# EAGLE schematic ascender_board (EAGLE 6.6.0)
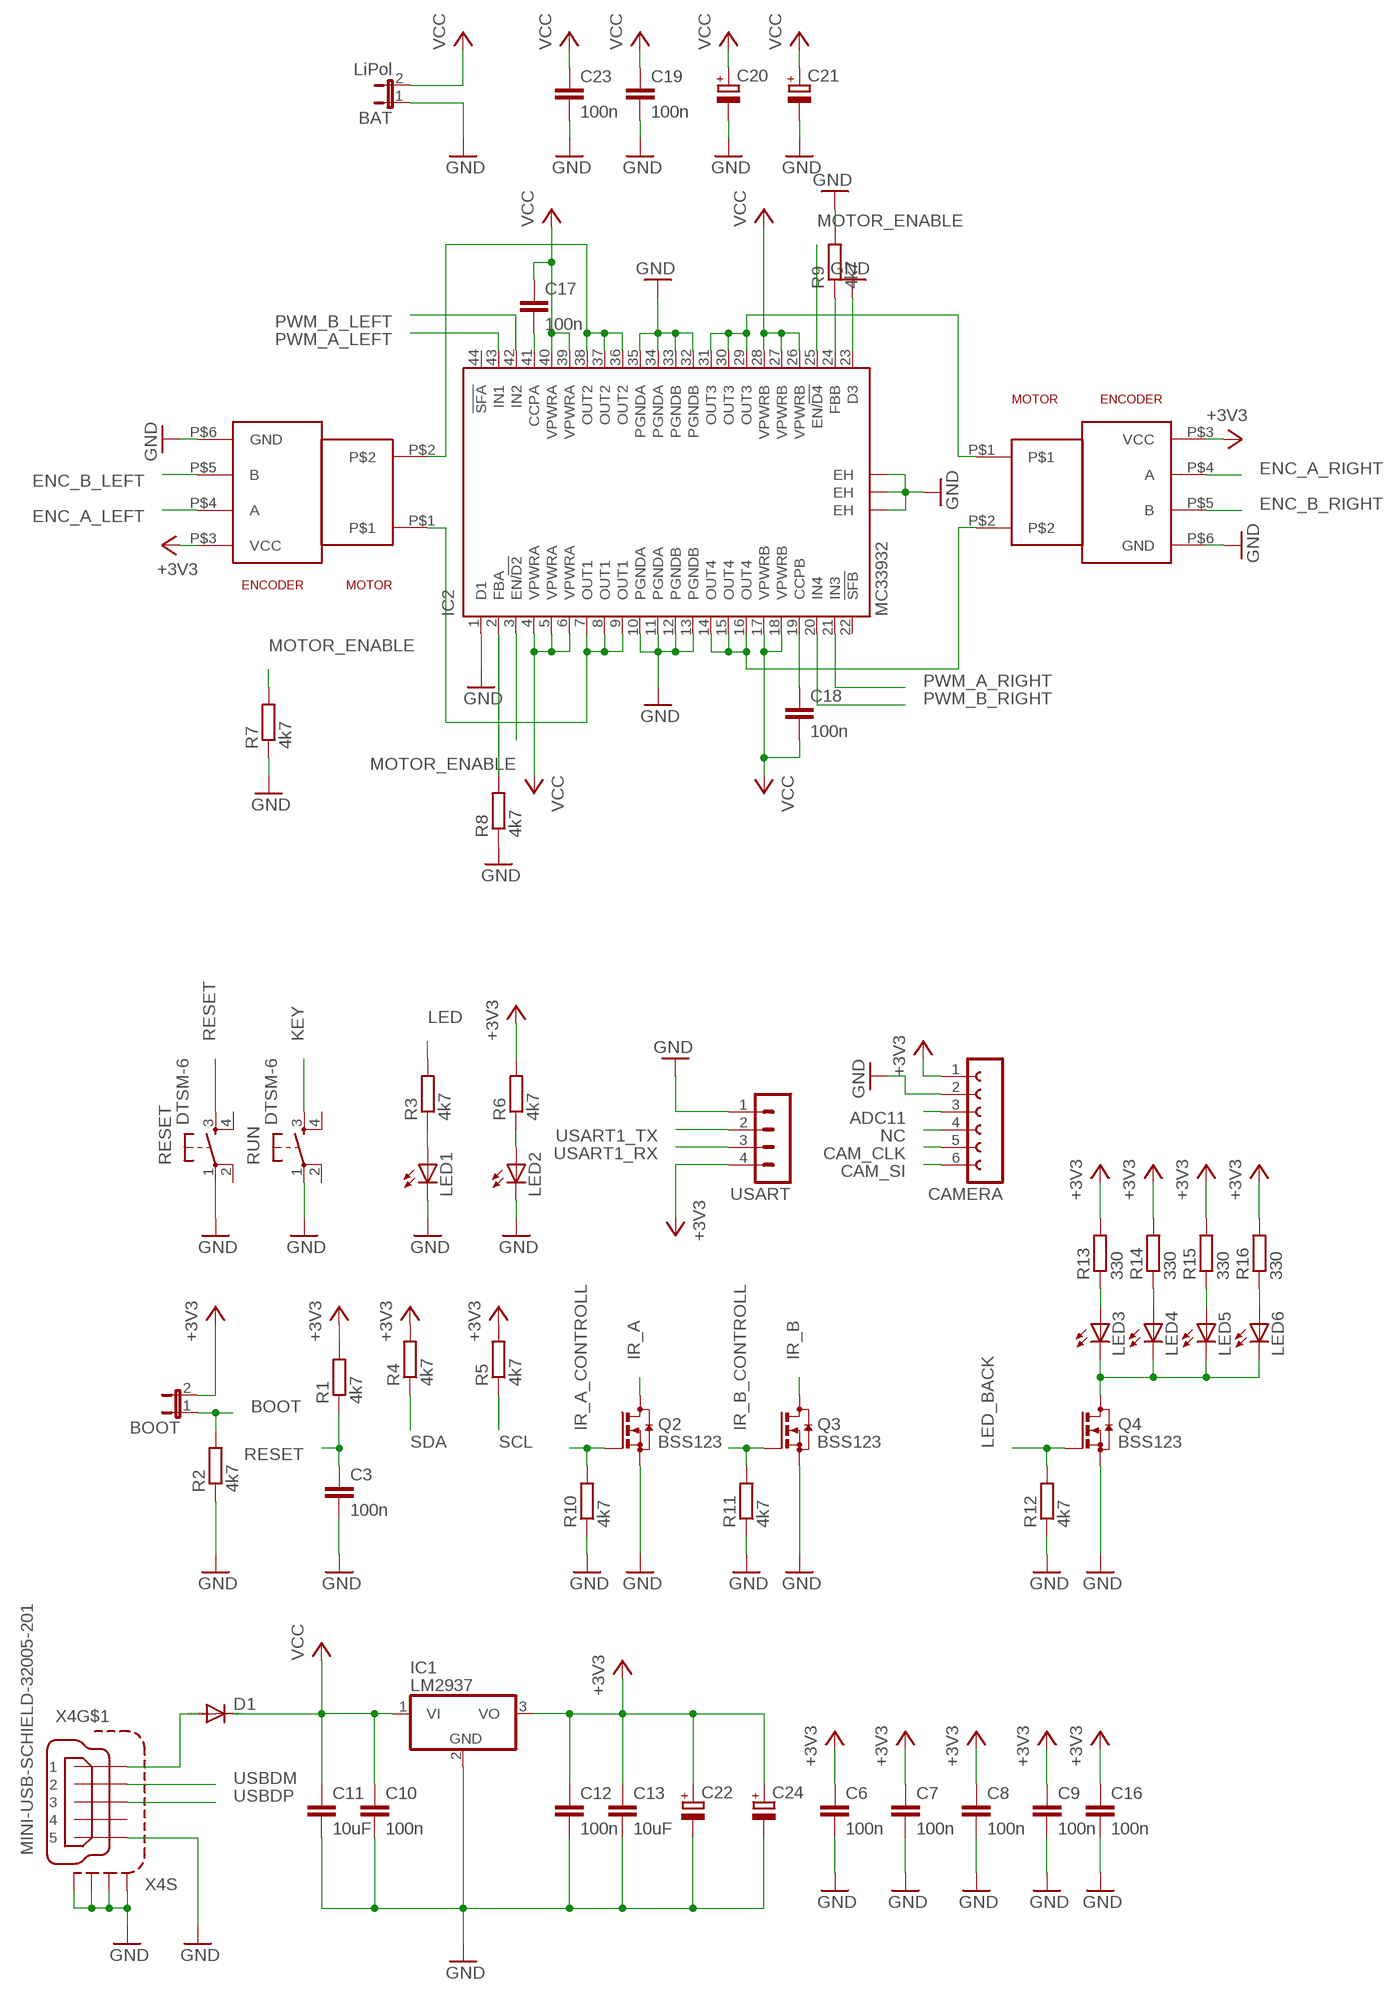
[diagram p0: schematic, sheet 1, part 1 of 2]
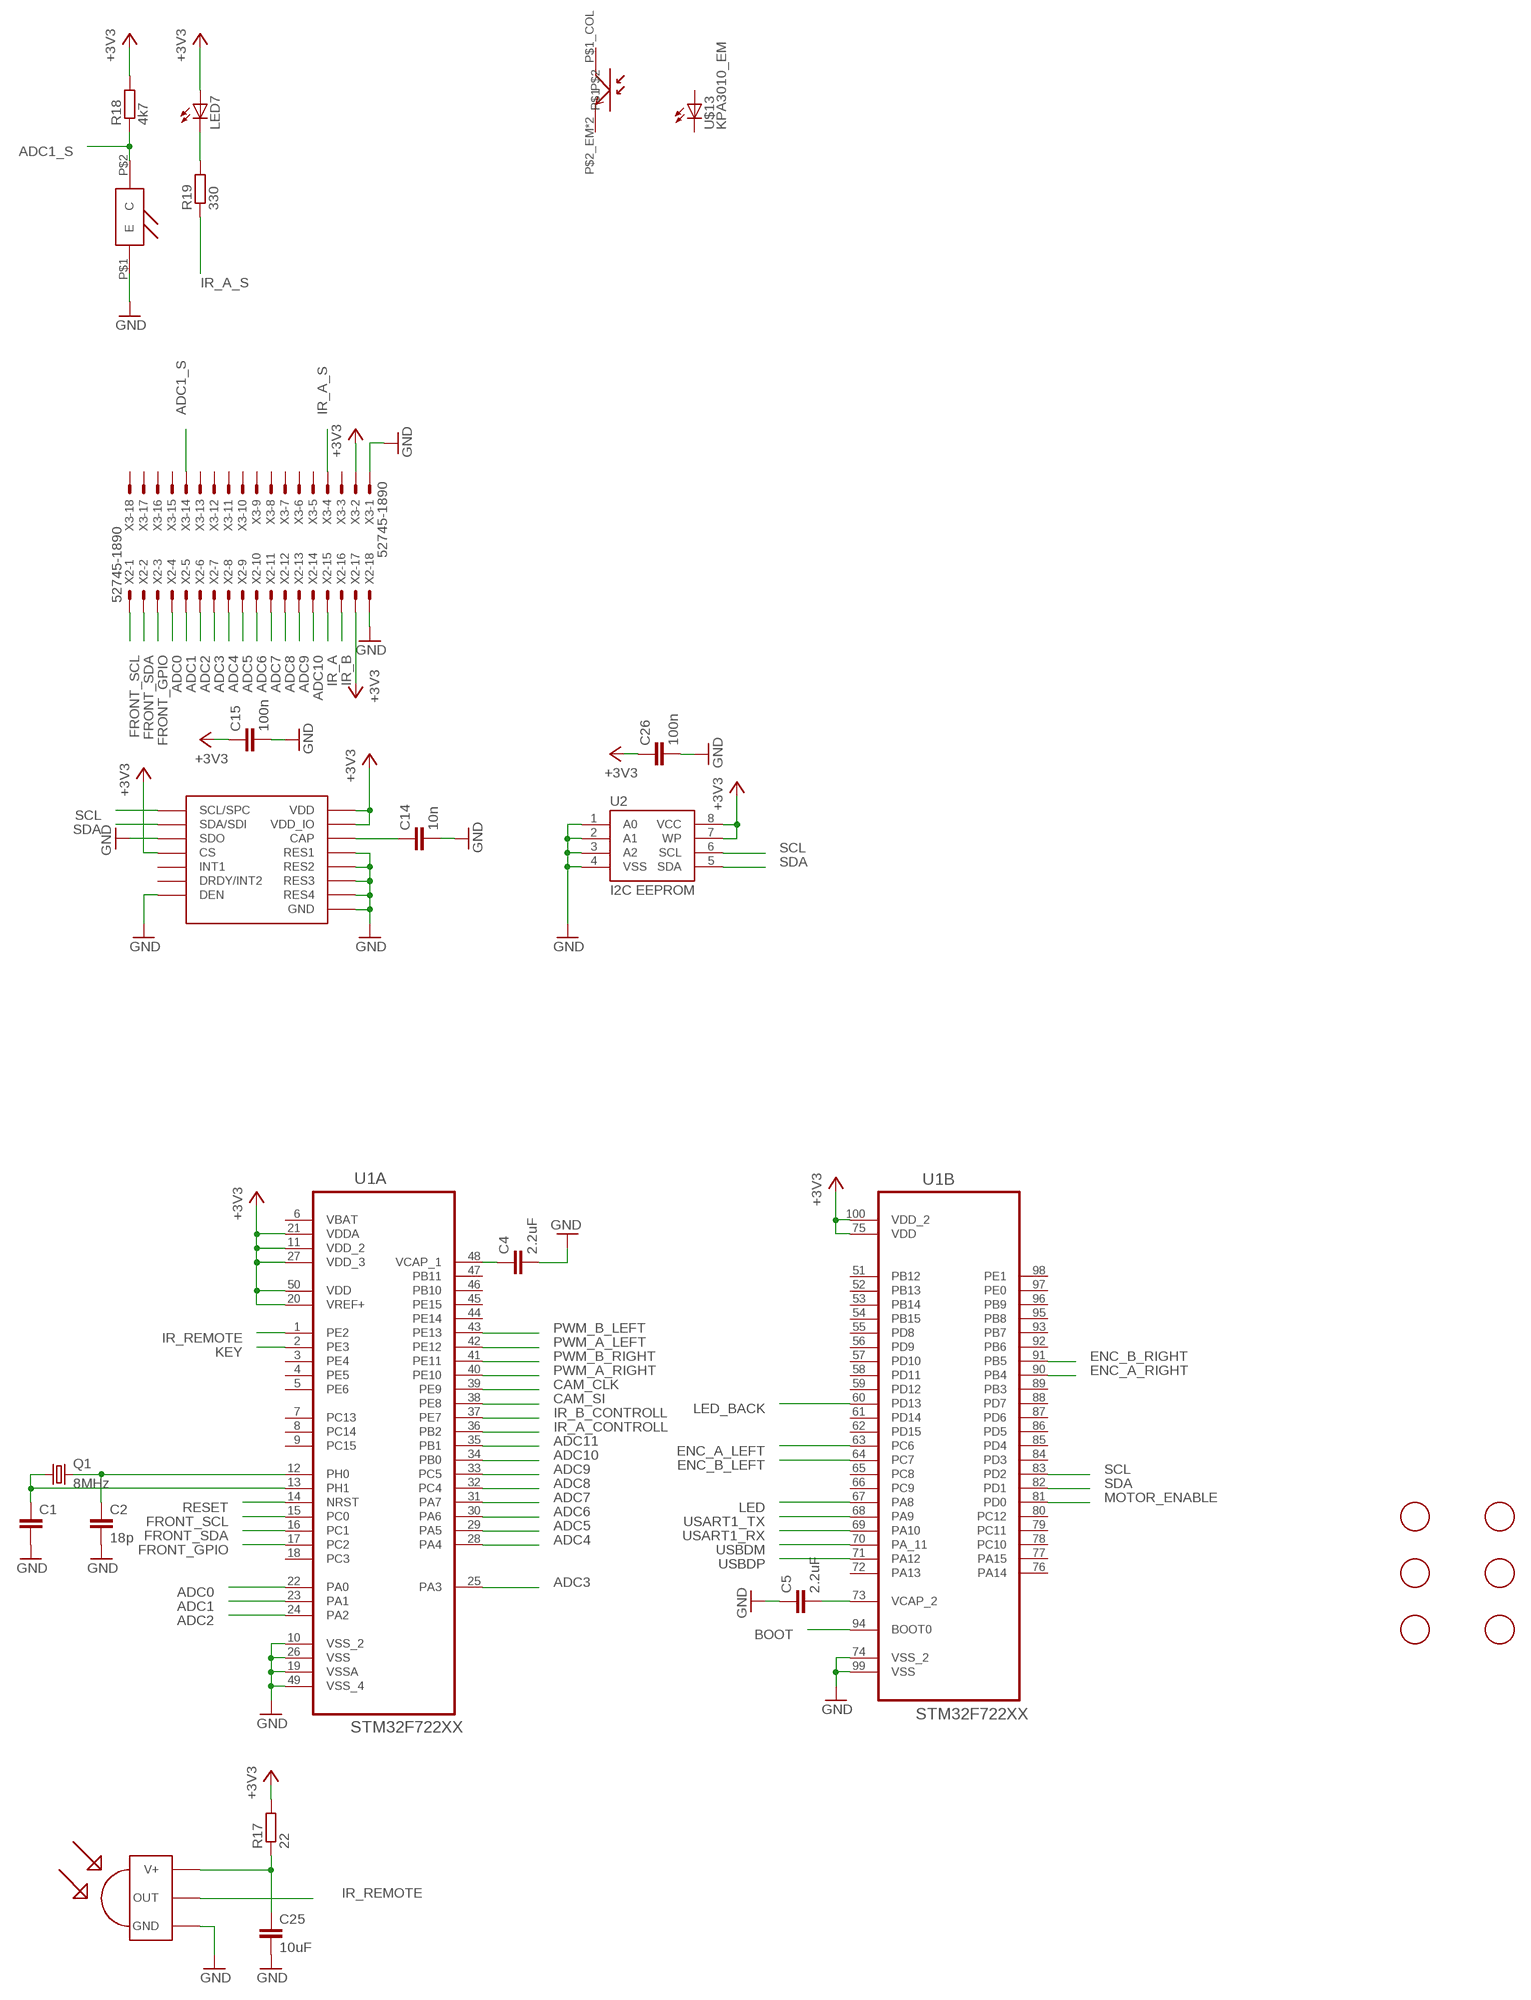
[diagram p1: schematic, sheet 1, part 2 of 2]

## Parts
BAT  LiPol  JP1E  [JP1]
BOOT  JP1E  [JP1]
C1  C-EUC0805  [C0805]
C2  18p  C-EUC0805  [C0805]
C3  100n  C-EUC0805  [C0805]
C4  2.2uF  C-EUC0805  [C0805]
C5  2.2uF  C-EUC0805  [C0805]
C6  100n  C-EUC0805  [C0805]
C7  100n  C-EUC0805  [C0805]
C8  100n  C-EUC0805  [C0805]
C9  100n  C-EUC0805  [C0805]
C10  100n  C-EUC0805  [C0805]
C11  10uF  C-EUC0805  [C0805]
C12  100n  C-EUC0805  [C0805]
C13  10uF  C-EUC0805  [C0805]
C14  10n  C-EUC0805  [C0805]
C15  100n  C-EUC0805  [C0805]
C16  100n  C-EUC0805  [C0805]
C17  100n  C-EUC0805  [C0805]
C18  100n  C-EUC0805  [C0805]
C19  100n  C-EUC0805  [C0805]
C20  CPOL-EU153CLV-0505  [153CLV-0505]
C21  CPOL-EU153CLV-0505  [153CLV-0505]
C22  CPOL-EU153CLV-0505  [153CLV-0505]
C23  100n  C-EUC0805  [C0805]
C24  CPOL-EU153CLV-0505  [153CLV-0505]
C25  10uF  C-EUC0805  [C0805]
C26  100n  C-EUC0805  [C0805]
CAMERA  FE06-1  [FE06]
D1  DIODE-DO-214AC  [DO-214AC]
IC1  LM2937  [TO263-3]
IC2  MC33932  [HSOP44]
LED1  LEDCHIPLED_1206  [CHIPLED_1206]
LED2  LEDCHIPLED_1206  [CHIPLED_1206]
LED3  LEDCHIPLED_1206  [CHIPLED_1206]
LED4  LEDCHIPLED_1206  [CHIPLED_1206]
LED5  LEDCHIPLED_1206  [CHIPLED_1206]
LED6  LEDCHIPLED_1206  [CHIPLED_1206]
LED7  LEDCHIPLED_1206  [CHIPLED_1206]
Q1  8MHz  CRYSTALCTS406  [CTS406]
Q2  BSS123  [SOT23]
Q3  BSS123  [SOT23]
Q4  BSS123  [SOT23]
R1  4k7  R-EU_M0805  [M0805]
R2  4k7  R-EU_M0805  [M0805]
R3  4k7  R-EU_M0805  [M0805]
R4  4k7  R-EU_M0805  [M0805]
R5  4k7  R-EU_M0805  [M0805]
R6  4k7  R-EU_M0805  [M0805]
R7  4k7  R-EU_M0805  [M0805]
R8  4k7  R-EU_M0805  [M0805]
R9  4k7  R-EU_M0805  [M0805]
R10  4k7  R-EU_M0805  [M0805]
R11  4k7  R-EU_M0805  [M0805]
R12  4k7  R-EU_M0805  [M0805]
R13  330  R-EU_M0805  [M0805]
R14  330  R-EU_M0805  [M0805]
R15  330  R-EU_M0805  [M0805]
R16  330  R-EU_M0805  [M0805]
R17  22  R-EU_M0805  [M0805]
R18  4k7  R-EU_M0805  [M0805]
R19  330  R-EU_M0805  [M0805]
RESET  DTSM-6  [DTSM-6]
RUN  DTSM-6  [DTSM-6]
U1  STM32F722XX  [QFP50P1600X1600X160-100N]
U2  I2C EEPROM  EEPROM-I2CEIAJ  [SO08-EIAJ]
U$1  POLOLU_GEAR_MOTORPOLO  [POLOLU_GEAR_MOTOR]
U$2  ST_L3GD20H  [ST_LGA16L]
U$3  FIDUCIAL  [FIDUCIAL_1MM]
U$4  FIDUCIAL  [FIDUCIAL_1MM]
U$5  FIDUCIAL  [FIDUCIAL_1MM]
U$6  FIDUCIAL  [FIDUCIAL_1MM]
U$7  FIDUCIAL  [FIDUCIAL_1MM]
U$8  FIDUCIAL  [FIDUCIAL_1MM]
U$9  TSOP4830  [TSOP18XX]
U$10  POLOLU_GEAR_MOTORPOLO  [POLOLU_GEAR_MOTOR]
U$11  SFH3710  [SFH3710]
U$12  KPA3010  [KPA3010]
U$13  KPA3010_EM  [KPA3010]
USART  MA04-1  [MA04-1]
X2  52745-1890  [52745-1890]
X3  52745-1890  [52745-1890]
X4  MINI-USB-SCHIELD-32005-201  [32005-201]

## Nets
+3V3: BOOT.2 C6.1 C7.1 C8.1 C9.1 C12.1 C13.1 C15.1 C16.1 C22.+ C24.+ C26.1 CAMERA.1 IC1.3(VO) LED7.A R1.2 R4.2 R5.2 R6.2 R13.2 R14.2 R15.2 R16.2 R17.2 R18.2 U1.11(A:VDD_2) U1.20(A:VREF+) U1.21(A:VDDA) U1.27(A:VDD_3) U1.50(A:VDD) U1.75(B:VDD) U1.100(B:VDD_2) U2.7(WP) U2.8(VCC) U$1.P$3(VCC) U$2.P$1(VDD_IO) U$2.P$5(CS) U$2.P$16(VDD) U$10.P$3(VCC) USART.4 X2.17 X3.2
ADC0: U1.22(A:PA0) X2.4
ADC1: U1.23(A:PA1) X2.5
ADC1_S: R18.1 U$11.P$2(C) X3.14
ADC2: U1.24(A:PA2) X2.6
ADC3: U1.25(A:PA3) X2.7
ADC4: U1.28(A:PA4) X2.8
ADC5: U1.29(A:PA5) X2.9
ADC6: U1.30(A:PA6) X2.10
ADC7: U1.31(A:PA7) X2.11
ADC8: U1.32(A:PC4) X2.12
ADC9: U1.33(A:PC5) X2.13
ADC10: U1.34(A:PB0) X2.14
ADC11: CAMERA.3 U1.35(A:PB1)
BOOT: BOOT.1 R2.2 U1.94(B:BOOT0)
CAM_CLK: CAMERA.5 U1.39(A:PE9)
CAM_SI: CAMERA.6 U1.38(A:PE8)
ENC_A_LEFT: U1.63(B:PC6) U$10.P$4(A)
ENC_A_RIGHT: U1.90(B:PB4) U$1.P$4(A)
ENC_B_LEFT: U1.64(B:PC7) U$10.P$5(B)
ENC_B_RIGHT: U1.91(B:PB5) U$1.P$5(B)
FRONT_GPIO: U1.17(A:PC2) X2.3
FRONT_SCL: U1.15(A:PC0) X2.1
FRONT_SDA: U1.16(A:PC1) X2.2
GND: BAT.1 C1.2 C2.2 C3.2 C4.2 C5.1 C6.2 C7.2 C8.2 C9.2 C10.2 C11.2 C12.2 C13.2 C14.2 C15.2 C16.2 C19.2 C20.- C21.- C22.- C23.2 C24.- C25.2 C26.2 CAMERA.2 IC1.2(GND) IC2.1(D1) IC2.10(PGNDA) IC2.11(PGNDA) IC2.12(PGNDB) IC2.13(PGNDB) IC2.23(D3) IC2.32(PGNDB) IC2.33(PGNDB) IC2.34(PGNDA) IC2.35(PGNDA) IC2.EH@1(EH) IC2.EH@2(EH) IC2.EH@3(EH) LED1.C LED2.C Q2.2(S) Q3.2(S) Q4.2(S) R2.1 R7.1 R8.1 R9.2 R10.1 R11.1 R12.1 RESET.1 RUN.1 U1.10(A:VSS_2) U1.19(A:VSSA) U1.26(A:VSS) U1.49(A:VSS_4) U1.74(B:VSS_2) U1.99(B:VSS) U2.1(A0) U2.2(A1) U2.3(A2) U2.4(VSS) U$1.P$6(GND) U$2.P$4(SDO) U$2.P$8(DEN) U$2.P$9(RES1) U$2.P$10(RES2) U$2.P$11(RES3) U$2.P$12(GND) U$2.P$13(GND) U$2.P$15(RES4) U$9.GND U$10.P$6(GND) U$11.P$1(E) USART.1 X2.18 X3.1 X4.5 X4.M1(S:S1) X4.M2(S:S2) X4.M3(S:S3) X4.M4(S:S4)
IR_A: Q2.3(D) X2.15
IR_A_CONTROLL: Q2.1(G) R10.2 U1.36(A:PB2)
IR_A_S: R19.1 X3.4
IR_B: Q3.3(D) X2.16
IR_B_CONTROLL: Q3.1(G) R11.2 U1.37(A:PE7)
IR_REMOTE: U1.1(A:PE2) U$9.OUT
KEY: RUN.3 U1.2(A:PE3)
LED: R3.2 U1.67(B:PA8)
LED_BACK: Q4.1(G) R12.2 U1.60(B:PD13)
MOTOR_ENABLE: IC2.3(EN/!D2) IC2.25(EN/!D4) R7.2 U1.81(B:PD0)
N$1: C2.1 Q1.3 U1.12(A:PH0)
N$2: C1.1 Q1.1 U1.13(A:PH1)
N$3: C4.1 U1.48(A:VCAP_1)
N$4: C5.2 U1.73(B:VCAP_2)
N$5: LED1.A R3.1
N$6: C14.1 U$2.P$14(CAP)
N$7: IC2.7(OUT1) IC2.8(OUT1) IC2.9(OUT1) U$10.P$1
N$8: IC2.36(OUT2) IC2.37(OUT2) IC2.38(OUT2) U$10.P$2
N$9: IC2.14(OUT4) IC2.15(OUT4) IC2.16(OUT4) U$1.P$2
N$10: IC2.29(OUT3) IC2.30(OUT3) IC2.31(OUT3) U$1.P$1
N$11: LED2.A R6.1
N$12: C17.2 IC2.41(CCPA)
N$13: IC2.2(FBA) R8.2
N$14: C18.1 IC2.19(CCPB)
N$15: IC2.24(FBB) R9.1
N$16: LED3.C LED4.C LED5.C LED6.C Q4.3(D)
N$17: LED3.A R13.1
N$18: D1.A X4.1
N$19: LED4.A R14.1
N$20: C25.1 R17.1 U$9.VCC(V+)
N$21: LED5.A R15.1
N$23: LED6.A R16.1
N$24: LED7.C R19.2
NC: CAMERA.4
PWM_A_LEFT: IC2.43(IN1) U1.42(A:PE12)
PWM_A_RIGHT: IC2.21(IN3) U1.40(A:PE10)
PWM_B_LEFT: IC2.42(IN2) U1.43(A:PE13)
PWM_B_RIGHT: IC2.20(IN4) U1.41(A:PE11)
RESET: C3.1 R1.1 RESET.3 U1.14(A:NRST)
SCL: R5.1 U1.83(B:PD2) U2.6(SCL) U$2.P$2(SCL/SPC)
SDA: R4.1 U1.82(B:PD1) U2.5(SDA) U$2.P$3(SDA/SDI)
USART1_RX: U1.69(B:PA10) USART.3
USART1_TX: U1.68(B:PA9) USART.2
USBDM: U1.70(B:PA_11) X4.2
USBDP: U1.71(B:PA12) X4.3
VCC: BAT.2 C10.1 C11.1 C17.1 C18.2 C19.1 C20.+ C21.+ C23.1 D1.C IC1.1(VI) IC2.4(VPWRA) IC2.5(VPWRA) IC2.6(VPWRA) IC2.17(VPWRB) IC2.18(VPWRB) IC2.26(VPWRB) IC2.27(VPWRB) IC2.28(VPWRB) IC2.39(VPWRA) IC2.40(VPWRA)
Unconnected: IC2.22(!SFB) IC2.44(!SFA) RESET.2 RESET.4 RUN.2 RUN.4 U1.3(A:PE4) U1.4(A:PE5) U1.5(A:PE6) U1.7(A:PC13) U1.8(A:PC14) U1.9(A:PC15) U1.18(A:PC3) U1.44(A:PE14) U1.45(A:PE15) U1.46(A:PB10) U1.47(A:PB11) U1.51(B:PB12) U1.52(B:PB13) U1.53(B:PB14) U1.54(B:PB15) U1.55(B:PD8) U1.56(B:PD9) U1.57(B:PD10) U1.58(B:PD11) U1.59(B:PD12) U1.61(B:PD14) U1.62(B:PD15) U1.65(B:PC8) U1.66(B:PC9) U1.72(B:PA13) U1.76(B:PA14) U1.77(B:PA15) U1.78(B:PC10) U1.79(B:PC11) U1.80(B:PC12) U1.84(B:PD3) U1.85(B:PD4) U1.86(B:PD5) U1.87(B:PD6) U1.88(B:PD7) U1.89(B:PB3) U1.92(B:PB6) U1.93(B:PB7) U1.95(B:PB8) U1.96(B:PB9) U1.97(B:PE0) U1.98(B:PE1) U$2.P$6(DRDY/INT2) U$2.P$7(INT1) U$12.P$1_COL U$12.P$2_EM U$12.P$3-NC U$13.P$1_COL(C) U$13.P$2_EM(A) U$13.P$3-NC(A) X3.3 X3.5 X3.6 X3.7 X3.8 X3.9 X3.10 X3.11 X3.12 X3.13 X3.15 X3.16 X3.17 X3.18 X4.4

## Power pins joined to a net without a drawn wire
VBAT: U1.6(A:VBAT)

## Library data of the parts
BAT BOOT = jumper:JP1E: JUMPER
C1-C19 C23 C25 C26 = resistor:C-EU: CAPACITOR, European symbol
C20-C22 C24 = resistor:CPOL-EU: POLARIZED CAPACITOR, European symbol
CAMERA = con-lsta:FE06-1: FEMALE HEADER; OC_FARNELL: unknown; OC_NEWARK: unknown
D1 = diode:DIODE-: DIODE
IC1 = my_parts:LM2937: LM2937-2.5, LM2937-3.3 400mA and 500mA Voltage Regulators Source: http://cache.national.com/ds/LM/LM2937-2.5.pdf
IC2 = freescale:MC33932: 5.0 A Throttle Control H-Bridge Auto generated by make-symbol-device-package-bsdl.ulp Rev. 33 Source: http://www.freescale.com/files/analog/doc/data_sheet/MC33932.pdf?fpsp=1; MPN: MC33932VW; OC_FARNELL: 1701639; OC_NEWARK: 67P3304
LED1-LED7 = my_parts:LED: LED OSRAM: - CHIPLED LG R971, LG N971, LY N971, LG Q971, LY Q971, LO R971, LY R971 LH N974, LH R974 LS Q976, LO Q976, LY Q976 LO Q996 - Hyper CHIPLED LW Q18S LB Q993, LB Q99A, LB R99A - SideLED LS A670, LO A670, LY A670, LG A670, LP A670 LB A673, LV A673, LT A673, LW A673 LH A674 LY A675 LS A676, LA A676, LO A676, LY A676, LW A676 LS A679, LY A679, LG A679 - Hyper Micro SIDELED® LS Y876, LA Y876, LO Y876, LY Y876 LT Y87S - SmartLED LW L88C, LW L88S LB L89C, LB L89S, LG L890 LS L89K, LO L89K, LY L89K LS L896, LA L896, LO L896, LY L896 - TOPLED LS T670, LO T670, LY T670, LG T670, LP T670 LSG T670, LSP T670, LSY T670, LOP T670, LYG T670 LG T671, LOG T671, LSG T671 LB T673, LV T673, LT T673, LW T673 LH T674 LS T676, LA T676, LO T676, LY T676, LB T676, LH T676, LSB T676, LW T676 LB T67C, LV T67C, LT T67C, LS T67K, LO T67K, LY T67K, LW E67C LS E67B, LA E67B, LO E67B, LY E67B, LB E67C, LV E67C, LT E67C LW T67C LS T679, LY T679, LG T679 LS T770, LO T770, LY T770, LG T770, LP T770 LB T773, LV T773, LT T773, LW T773 LH T774 LS E675, LA E675, LY E675, LS T675 LS T776, LA T776, LO T776, LY T776, LB T776 LHGB T686 LT T68C, LB T68C - Hyper Mini TOPLED® LB M676 - Mini TOPLED Santana® LG M470 LS M47K, LO M47K, LY M47K Source: http://www.osram.convergy.de LUXEON: - LUMILED® LXK2-PW12-R00, LXK2-PW12-S00, LXK2-PW14-U00, LXK2-PW14-V00 LXK2-PM12-R00, LXK2-PM12-S00, LXK2-PM14-U00 LXK2-PE12-Q00, LXK2-PE12-R00, LXK2-PE12-S00, LXK2-PE14-T00, LXK2-PE14-U00 LXK2-PB12-K00, LXK2-PB12-L00, LXK2-PB12-M00, LXK2-PB14-N00, LXK2-PB14-P00, LXK2-PB14-Q00 LXK2-PR12-L00, LXK2-PR12-M00, LXK2-PR14-Q00, LXK2-PR14-R00 LXK2-PD12-Q00, LXK2-PD12-R00, LXK2-PD12-S00 LXK2-PH12-R00, LXK2-PH12-S00 LXK2-PL12-P00, LXK2-PL12-Q00, LXK2-PL12-R00 Source: www.luxeon.com KINGBRIGHT: KA-3528ASYC Source: www.kingbright.com
Q1 = crystal:CRYSTAL: CRYSTAL; OC_FARNELL: unknown; OC_NEWARK: unknown
Q2-Q4 = transistor-small-signal:BSS123: N-CHANNEL MOS FET
R1-R19 = resistor:R-EU_: RESISTOR, European symbol
RESET RUN = switch-tact:DTSM-6
U1 = stm32:STM32F722XX: IC, MCU, 32BIT, 512K FLASH, 100LQFP; MPN: STM32F407VET6; OC_FARNELL: 2064367; OC_NEWARK: 73T2332; PACKAGE: 100LQFP; SUPPLIER: STMicroelectronics
U2 = SparkFun-IC-Memory:EEPROM-I2C: I2C EEPROMs, 24LC256 and others 24LC256 Series 256 kb I2C 2 Wire (32 k x 8 Bit) 2.5 V Serial EEPROM SMD - SOIC-8 Datasheet SparkFun Products SparkFun UDB5 - PIC UAV Development Board <https://www.sparkfun.com/products/11703> (GPS-11703); PROD_ID: NA-XXXXX
U$1 U$10 = my_parts:POLOLU_GEAR_MOTOR
U$2 = main:ST_L3GD20H
U$3-U$8 = adafruit:FIDUCIAL: For use by pick and place machines to calibrate the vision/machine, 1mm By microbuilder.eu
U$9 = tsop:TSOP4830: IR Receiver and Demodulator
U$11 = my_parts:SFH3710
U$12 = my_parts:KPA3010
U$13 = my_parts:KPA3010_EM
USART = con-lstb:MA04-1: PIN HEADER; OC_FARNELL: unknown; OC_NEWARK: unknown
X2 X3 = con-molex:52745-1890: FFC/FPC-to-Board 0.50mm (.020") SMT Top Contact Right Angle, ZIF, Style Receptacle 52745 / 52435 Source: http://www.molex.com/product/ffc/52745.html; MPN: 52745-1890; OC_FARNELL: unknown; OC_NEWARK: 66F4273
X4 = con-cypressindustries:MINI-USB-SCHIELD-: MINI USB-B Conector Source: www.cypressindustries.com; OC_FARNELL: unknown; OC_NEWARK: unknown